# Altium project jjfy_2.PrjPCB
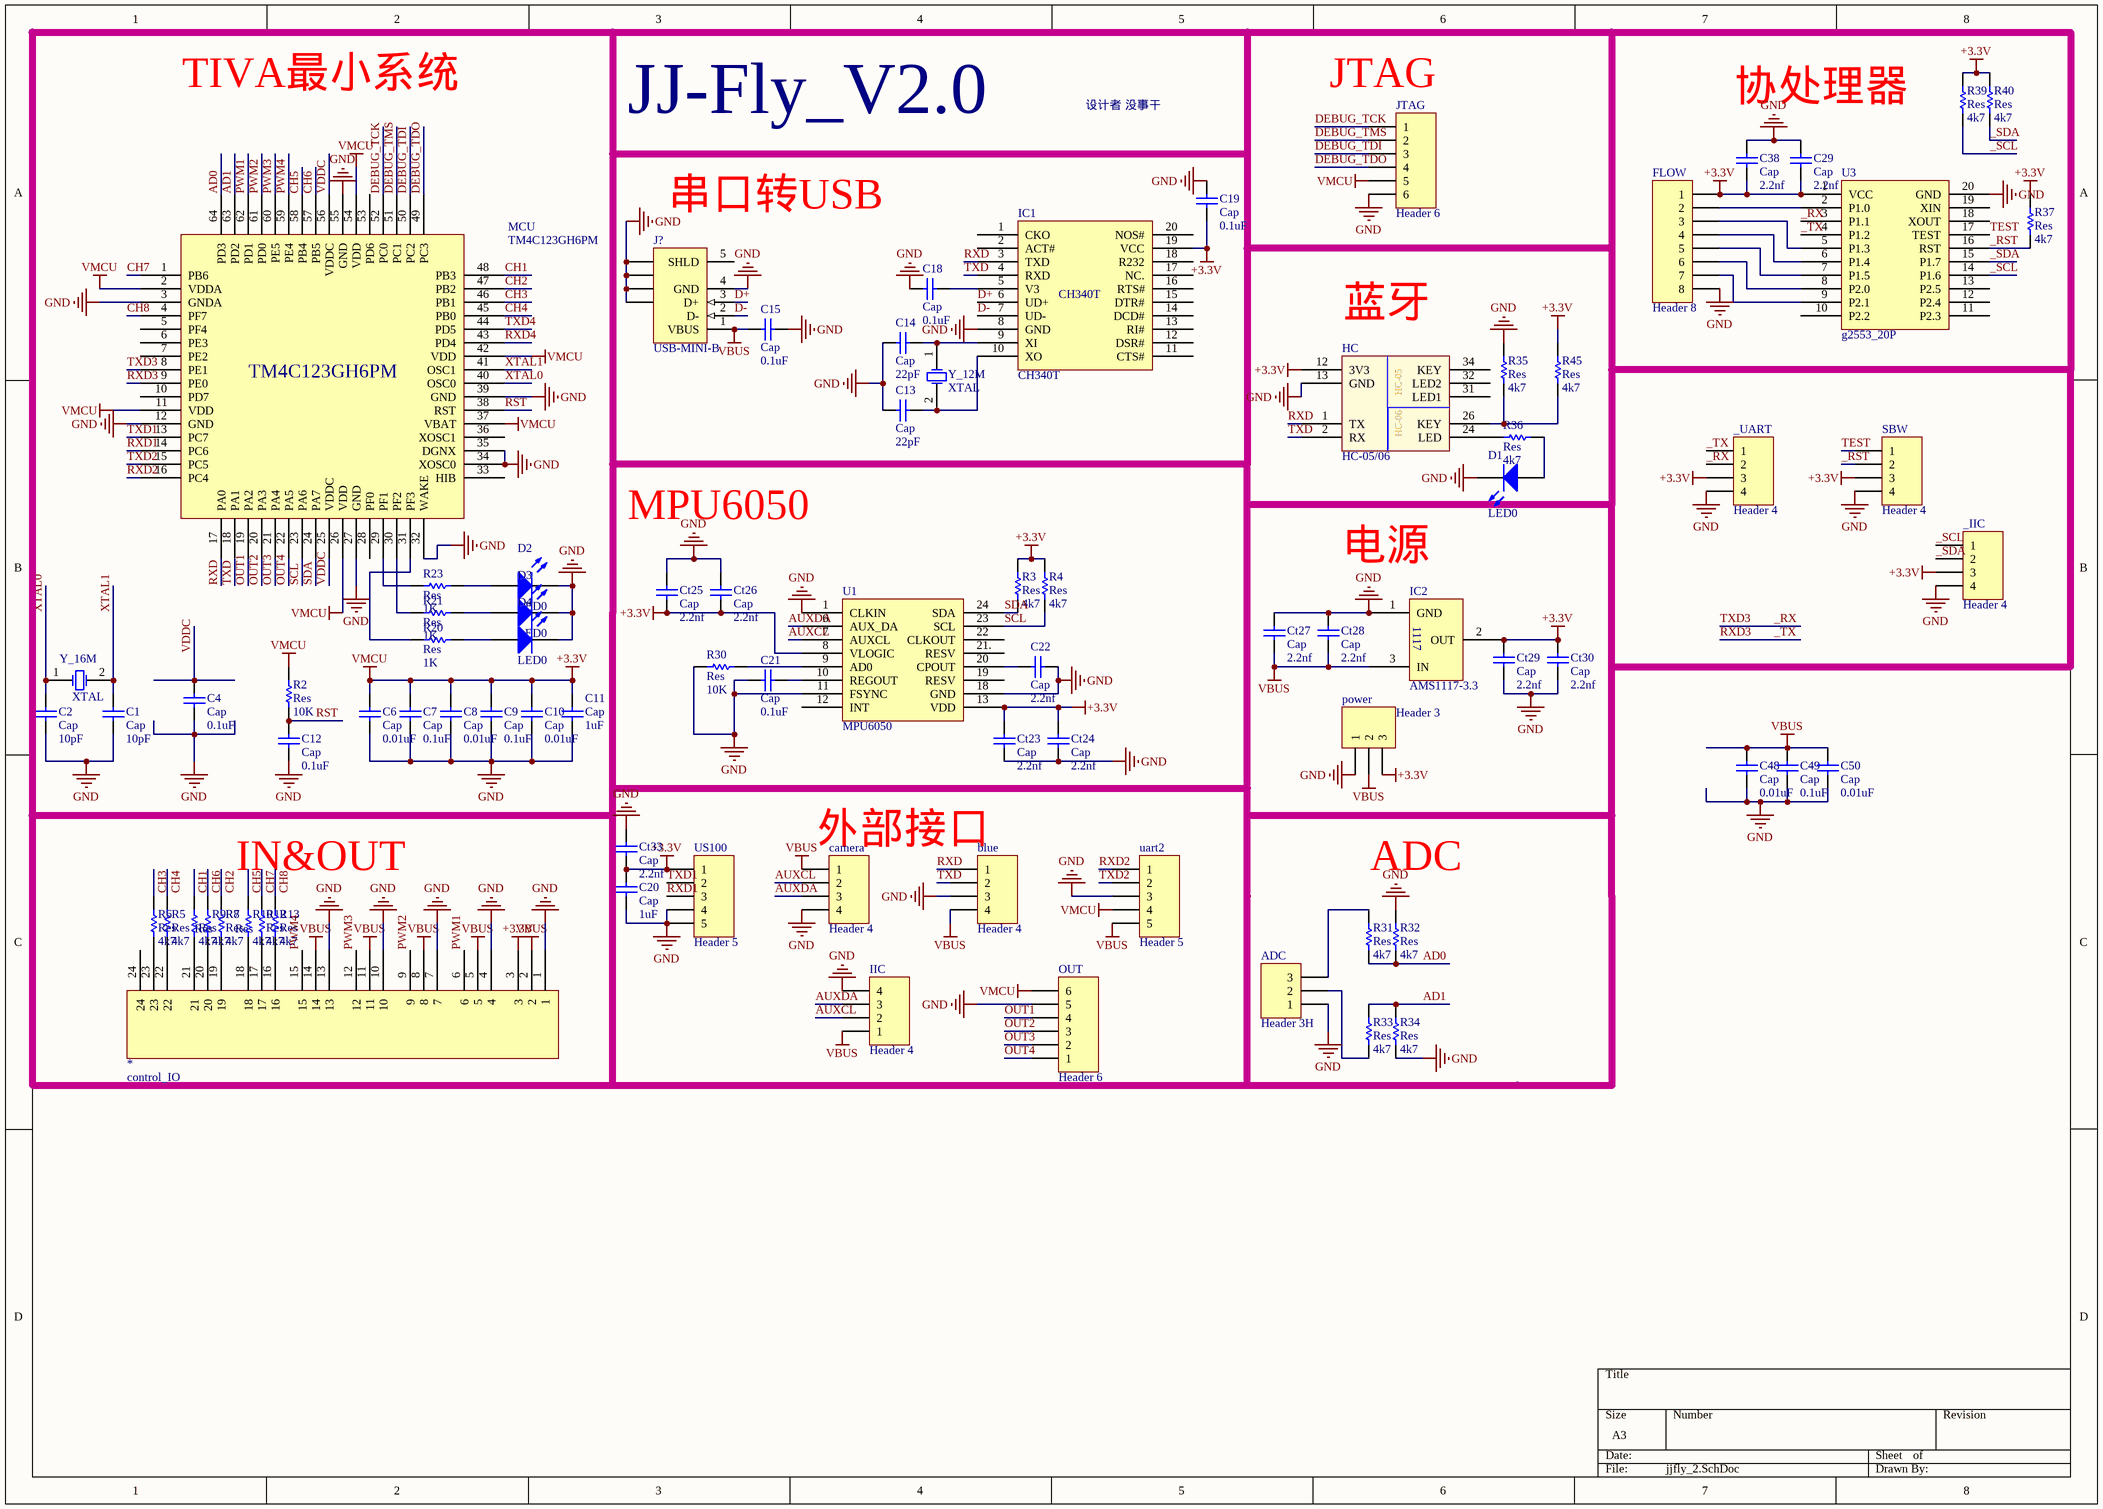
[diagram p0: jjfly_2.SchDoc]
1 sheet, 84 parts. Net scope: global (net labels, ports and power ports of the same name join across sheets).
Board file: jjfly_2.PcbDoc

## Sheet jjfly_2.SchDoc
size A3

### Parts
*  control_IO  [IN&OUT]
_IIC  Header 4  [H_1.25_4P]
_UART  Header 4  [H_1.25_4P]
ADC  Header 3H  [H_1.25_3P]
blue  Header 4  [H_1.25_4P]
C1  Cap  value 10pF  [1608[0603]]
C2  Cap  value 10pF  [1608[0603]]
C4  Cap  value 0.1uF  [1608[0603]]
C6  Cap  value 0.01uF  [1608[0603]]
C7  Cap  value 0.1uF  [1608[0603]]
C8  Cap  value 0.01uF  [1608[0603]]
C9  Cap  value 0.1uF  [1608[0603]]
C10  Cap  value 0.01uF  [1608[0603]]
C11  Cap  value 1uF  [1608[0603]]
C12  Cap  value 0.1uF  [1608[0603]]
C13  Cap  value 22pF  [1608[0603]]
C14  Cap  value 22pF  [1608[0603]]
C15  Cap  value 0.1uF  [1608[0603]]
C18  Cap  value 0.1uF  [1608[0603]]
C19  Cap  value 0.1uF  [1608[0603]]
C20  Cap  value 1uF  [1608[0603]]
C21  Cap  value 0.1uF  [1608[0603]]
C22  Cap  value 2.2nf  [1608[0603]]
C29  Cap  value 2.2nf  [1608[0603]]
C38  Cap  value 2.2nf  [1608[0603]]
C48  Cap  value 0.01uF  [1608[0603]]
C49  Cap  value 0.1uF  [1608[0603]]
C50  Cap  value 0.01uF  [1608[0603]]
camera  Header 4  [H_1.25_4P]
Ct23  Cap  value 2.2nf  [6-0805_N]
Ct24  Cap  value 2.2nf  [6-0805_N]
Ct25  Cap  value 2.2nf  [6-0805_N]
Ct26  Cap  value 2.2nf  [6-0805_N]
Ct27  Cap  value 2.2nf  [6-0805_N]
Ct28  Cap  value 2.2nf  [6-0805_N]
Ct29  Cap  value 2.2nf  [6-0805_N]
Ct30  Cap  value 2.2nf  [6-0805_N]
Ct33  Cap  value 2.2nf  [6-0805_N]
D1  LED0  [1608[0603]]
D2  LED0  [1608[0603]]
D3  LED0  [1608[0603]]
D4  LED0  [1608[0603]]
FLOW  Header 8  [H_1.25_8P]
HC  HC-05/06  [HC-05/06]
IC1  CH340T  [SSOP20]
IC2  AMS1117-3.3  [_SOT-223]
IIC  Header 4  [H_1.25_4P]
J?  USB-MINI-B  [USB-MINI-B]
JTAG  Header 6  [H_1.25_6P]
MCU  TM4C123GH6PM  [TQFP64]
OUT  Header 6  [H_1.25_6P]
power  Header 3  [H_1.25_3P]
R2  Res  value 10K  [1608[0603]]
R3  Res  value 4k7  [1608[0603]]
R4  Res  value 4k7  [1608[0603]]
R5  Res  value 4k7  [1608[0603]]
R6  Res  value 4k7  [1608[0603]]
R7  Res  value 4k7  [1608[0603]]
R8  Res  value 4k7  [1608[0603]]
R9  Res  value 4k7  [1608[0603]]
R10  Res  value 4k7  [1608[0603]]
R12  Res  value 4k7  [1608[0603]]
R13  Res  value 4k7  [1608[0603]]
R20  Res  value 1K  [1608[0603]]
R21  Res  value 1K  [1608[0603]]
R23  Res  value 1K  [1608[0603]]
R30  Res  value 10K  [1608[0603]]
R31  Res  value 4k7  [1608[0603]]
R32  Res  value 4k7  [1608[0603]]
R33  Res  value 4k7  [1608[0603]]
R34  Res  value 4k7  [1608[0603]]
R35  Res  value 4k7  [1608[0603]]
R36  Res  value 4k7  [1608[0603]]
R37  Res  value 4k7  [1608[0603]]
R39  Res  value 4k7  [1608[0603]]
R40  Res  value 4k7  [1608[0603]]
R45  Res  value 4k7  [1608[0603]]
SBW  Header 4  [H_1.25_4P]
U1  MPU6050  [QFN24]
U3  g2553_20P  [TSSOP20]
uart2  Header 5  [H_1.25_5P]
US100  Header 5  [H_1.25_5P]
Y_12M  XTAL  [CAPC4532L]
Y_16M  XTAL  [CAPC4532L]

### Nets
+3.3V: *.3 _IIC.3 _UART.3 C6.2 C7.2 C8.2 C9.2 C10.2 C11.2 C19.1 C20.2 C29.1 C38.1 Ct23.2 Ct24.2 Ct25.1 Ct26.1 Ct29.2 Ct30.2 Ct33.1 FLOW.1 HC.12(3V3) IC1.19(VCC) IC2.2(OUT) JTAG.5 MCU.2(VDDA) MCU.11(VDD) MCU.26(VDD) MCU.37(VBAT) MCU.42(VDD) MCU.54(VDD) OUT.6 power.3 R2.2 R3.2 R4.2 R37.1 R39.2 R40.2 R45.1 SBW.3 U1.8(VLOGIC) U1.13(VDD) U3.1(VCC) uart2.4 US100.1  [also labelled VMCU]
GND: *.1 *.4 *.7 *.10 *.13 _IIC.4 _UART.4 ADC.1 blue.3 C1.1 C2.1 C4.1 C6.1 C7.1 C8.1 C9.1 C10.1 C11.1 C12.1 C13.2 C14.2 C15.1 C18.2 C19.2 C20.1 C21.1 C22.2 C29.2 C38.2 C48.1 C49.1 C50.1 camera.4 Ct23.1 Ct24.1 Ct25.2 Ct26.2 Ct27.2 Ct28.2 Ct29.1 Ct30.1 Ct33.2 D1.2(K) D2.2(K) D3.2(K) D4.2(K) FLOW.8 HC.13(GND) IC1.8(GND) IC2.1(GND) IIC.4 J?.4(GND) J?.6(SHLD) J?.7(SHLD) J?.8(SHLD) J?.9(SHLD) JTAG.6 MCU.3(GNDA) MCU.12(GND) MCU.27(GND) MCU.32(WAKE) MCU.34(XOSC0) MCU.35(DGNX) MCU.39(GND) MCU.55(GND) OUT.5 power.1 R30.2 R32.1 R34.2 R35.1 SBW.4 U1.1(CLKIN) U1.11(FSYNC) U1.18(GND) U3.20(GND) uart2.3 US100.4 US100.5
VBUS: *.2 *.5 *.8 *.11 *.14 blue.4 C15.2 C48.2 C49.2 C50.2 camera.1 Ct27.1 Ct28.1 IC2.3(IN) IIC.1 J?.1(VBUS) power.2 uart2.5
_RST: R37.2 SBW.2 U3.16(RST)
_RX: _UART.2 MCU.8(PE1) U3.3(P1.1)  [also labelled TXD3]
_SCL: _IIC.1 R39.1 U3.14(P1.6)
_SDA: _IIC.2 R40.1 U3.15(P1.7)
_TX: _UART.1 MCU.9(PE0) U3.4(P1.2)  [also labelled RXD3]
AD0: MCU.64(PD3) R31.2 R32.2
AD1: MCU.63(PD2) R33.1 R34.1
AUXCL: camera.2 IIC.2 U1.7(AUXCL)
AUXDA: camera.3 IIC.3 U1.6(AUX_DA)
CH1: MCU.48(PB3) R8.2
CH2: MCU.47(PB2) R7.2
CH3: MCU.46(PB1) R6.2
CH4: MCU.45(PB0) R5.2
CH5: MCU.58(PB4) R10.2
CH6: MCU.57(PB5) R9.2
CH7: MCU.1(PB6) R12.2
CH8: MCU.4(PF7) R13.2
D+: IC1.6(UD+) J?.3(D+)
D-: IC1.7(UD-) J?.2(D-)
DEBUG_TCK: JTAG.1 MCU.52(PC0)
DEBUG_TDI: JTAG.3 MCU.50(PC2)
DEBUG_TDO: JTAG.4 MCU.49(PC3)
DEBUG_TMS: JTAG.2 MCU.51(PC1)
OUT1: MCU.19(PA2) OUT.4
OUT2: MCU.20(PA3) OUT.3
OUT3: MCU.21(PA4) OUT.2
OUT4: MCU.22(PA5) OUT.1
PWM1: *.6 MCU.62(PD1)
PWM2: *.9 MCU.61(PD0)
PWM3: *.12 MCU.60(PE5)
PWM4: *.15 MCU.59(PE4)
RST: C12.2 MCU.38(RST) R2.1
RXD: blue.1 HC.1(TX) IC1.3(TXD) MCU.17(PA0)
RXD1: MCU.14(PC6) US100.3
RXD2: MCU.16(PC4) uart2.1
RXD4: MCU.43(PD4)
SCL: MCU.23(PA6) R4.1 U1.23(SCL)
SDA: MCU.24(PA7) R3.1 U1.24(SDA)
TEST: SBW.1 U3.17(TEST)
TXD: blue.2 HC.2(RX) IC1.4(RXD) MCU.18(PA1)
TXD1: MCU.13(PC7) US100.2
TXD2: MCU.15(PC5) uart2.2
TXD4: MCU.44(PD5)
VDDC: C4.2 MCU.25(VDDC) MCU.56(VDDC)
XTAL0: C2.2 MCU.40(OSC0) Y_16M.1(OSC1)
XTAL1: C1.2 MCU.41(OSC1) Y_16M.2(OSC2)
Net*_16: *.16 R13.1
Net*_17: *.17 R12.1
Net*_18: *.18 R10.1
Net*_19: *.19 R7.1
Net*_20: *.20 R9.1
Net*_21: *.21 R8.1
Net*_22: *.22 R5.1
Net*_23: *.23 R6.1
NetADC_2: ADC.2 R33.2
NetADC_3: ADC.3 R31.1
NetC13_1: C13.1 IC1.10(XO) Y_12M.2(OSC2)
NetC14_1: C14.1 IC1.9(XI) Y_12M.1(OSC1)
NetC18_1: C18.1 IC1.5(V3)
NetC21_2: C21.2 U1.10(REGOUT)
NetC22_1: C22.1 U1.20(CPOUT)
NetD1_1: D1.1(A) R36.2
NetD2_1: D2.1(A) R23.2
NetD3_1: D3.1(A) R21.2
NetD4_1: D4.1(A) R20.2
NetFLOW_2: FLOW.2 U3.2(P1.0)
NetFLOW_3: FLOW.3 U3.5(P1.3)
NetFLOW_4: FLOW.4 U3.6(P1.4)
NetFLOW_5: FLOW.5 U3.7(P1.5)
NetFLOW_6: FLOW.6 U3.8(P2.0)
NetFLOW_7: FLOW.7 U3.9(P2.1)
NetHC_24: HC.24(LED) R36.1
NetHC_26: HC.26(KEY) R35.2 R45.2
NetMCU_29: MCU.29(PF1) R23.1
NetMCU_30: MCU.30(PF2) R21.1
NetMCU_31: MCU.31(PF3) R20.1
NetR30_1: R30.1 U1.9(AD0)

Not connected (* = marked no-connect by the designer): * 24; HC 31(LED1) 32(LED2) 34(KEY); IC1 1(CKO) 2(ACT#) 11(CTS#) 12(DSR#) 13(RI#) 14(DCD#) 15(DTR#) 16(RTS#) 17(NC.) 18(R232) 20(NOS#); J? 5(SHLD); MCU 5(PF4) 6(PE3) 7(PE2) 10(PD7) 28(PF0) 33(HIB) 36(XOSC1) 53(PD6); U1 12(INT) 19(RESV) 21.(RESV) 22(CLKOUT); U3 10(P2.2) 11(P2.3) 12(P2.4) 13(P2.5) 18(XOUT) 19(XIN)

### Notes on the sheet
- TIVA最小系统
- 设计者 没事干
- (near JTAG) JTAG
- (near R39) 协处理器
- JJ-Fly_V2.0
- (near J?) 串口转USB
- 蓝牙
- MPU6050
- 电源
- 外部接口
- IN&OUT
- ADC
- (in symbol AMS1117-3.3) 1117
- (in symbol HC-05/06) HC-05; HC-06

### Library data of the parts
_IIC _UART blue camera IIC SBW = Header 4: Header, 4-Pin; LatestRevisionDate: 17-Jul-2002; LatestRevisionNote: Re-released for DXP Platform.; Publisher: Altium Limited
ADC = Header 3H: Header, 3-Pin, Right Angle; LatestRevisionDate: 17-Jul-2002; LatestRevisionNote: Re-released for DXP Platform.; Publisher: Altium Limited
C1 C2 C4 C6-C15 C18-C22 C29 C38 C48-C50 Ct23-Ct30 Ct33 = Cap Semi: Capacitor (Semiconductor SIM Model); Published: 8-Jun-2000; LatestRevisionDate: 29-May-2009; LatestRevisionNote: IPC-7351 Footprint Added.; PackageReference: C1206; Publisher: Altium Limited; PackageDescription: Chip Capacitor
D1-D4 = LED1: Typical RED GaAs LED; Published: 8-Jun-2000; LatestRevisionDate: 08-Jul-2005; LatestRevisionNote: Mech Layer 1 removed.; PackageReference: LED-1; Publisher: Altium Limited
FLOW = Header 8: Header, 8-Pin; LatestRevisionDate: 17-Jul-2002; LatestRevisionNote: Re-released for DXP Platform.; Publisher: Altium Limited
HC = HC-05/06: HC-05/06 蓝牙模块
J? = USB-MINI-B: USB 2.0, Right Angle, SMT, A Type, Receptacle, 5 Position, Black; ContactMaterial: Phosphor Bronze; ContactPlating: Gold (30) over Nickel; PCB_Layout: Complies with manufacturer's recommendation.; DrillSize: Corresponds to nominal value.; PanelGround: Without; Published: 15-Jul-2004; DatasheetDocument: 15-Nov-2002; PackageDocument: 15-Nov-2002; PackageReference: 440478; Publisher: Altium Limited; HousingMaterial: Thermoplastic; ComponentLink1Description: Manufacturer Link; ComponentLink1URL: http://www.tycoelectronics.com/; ComponentLink2Description: Packaging Specification; ComponentLink2URL: http://ecommas.tycoelectronics.com/commerce/DocumentDelivery/DDEController?Action=showdoc&DocId=Customer+Drawing%7F440478%7FB%7Fpdf%7FEnglish%7FC_440478_B.pdf
JTAG OUT = Header 6: Header, 6-Pin; LatestRevisionDate: 17-Jul-2002; LatestRevisionNote: Re-released for DXP Platform.; Publisher: Altium Limited
power = Header 3: Header, 3-Pin; LatestRevisionDate: 17-Jul-2002; LatestRevisionNote: Re-released for DXP Platform.; Publisher: Altium Limited
R2-R10 R12 R13 R20 R21 R23 R30-R37 R39 R40 R45 = Res Semi: Semiconductor Resistor; Published: 8-Jun-2000; LatestRevisionDate: 17-Jul-2002; LatestRevisionNote: Re-released for DXP Platform.; PackageReference: AXIAL-0.5; Publisher: Altium Limited
uart2 US100 = Header 5: Header, 5-Pin; LatestRevisionDate: 17-Jul-2002; LatestRevisionNote: Re-released for DXP Platform.; Publisher: Altium Limited
Y_12M Y_16M = XTAL: Crystal Oscillator; Published: 8-Jun-2000; LatestRevisionDate: 17-Jul-2002; LatestRevisionNote: Re-released for DXP Platform.; PackageReference: R38; Publisher: Altium Limited